# Altium project MD029A.PrjPcb (part 2 of 3)

## Sheet MD029A_CSA.SchDoc
size Letter; Date: Not shown in title block; ApprovedBy: Not shown in title block; CheckedBy: Not shown in title block; Author: Not shown in title block; CompanyName: Not shown in title block; Engineer: Not shown in title block; Organization: Not shown in title block; Address1: Not shown in title block; Address2: Not shown in title block; Address3: Not shown in title block; Address4: Not shown in title block; DocumentNumber: 3; Revision: Use project parameter SCH_Rev; SheetNumber: 3; SheetTotal: 5; PageSetup: Record=PageOptions|CenterHorizontal=True|CenterVertical=True|PrintScale=1.00|XCorrection=1.00|YCorrection=1.00|PrintKind=0|BorderSize=5000000|LeftOffset=0|BottomOffset=0|Orientation=2|PaperLength=1000|PaperWidth=1000|Scale=100|PaperSource=15|PrintQuality=600|MediaType=1|DitherType=10|PaperKind=Letter|PrintScaleMode=1; CurrentTime: Not shown in title block; CurrentDate: Not shown in title block; Time: Not shown in title block; DocumentFullPathAndName: Not shown in title block; DocumentName: Not shown in title block; ModifiedDate: Not shown in title block; ImagePath: Not shown in title block
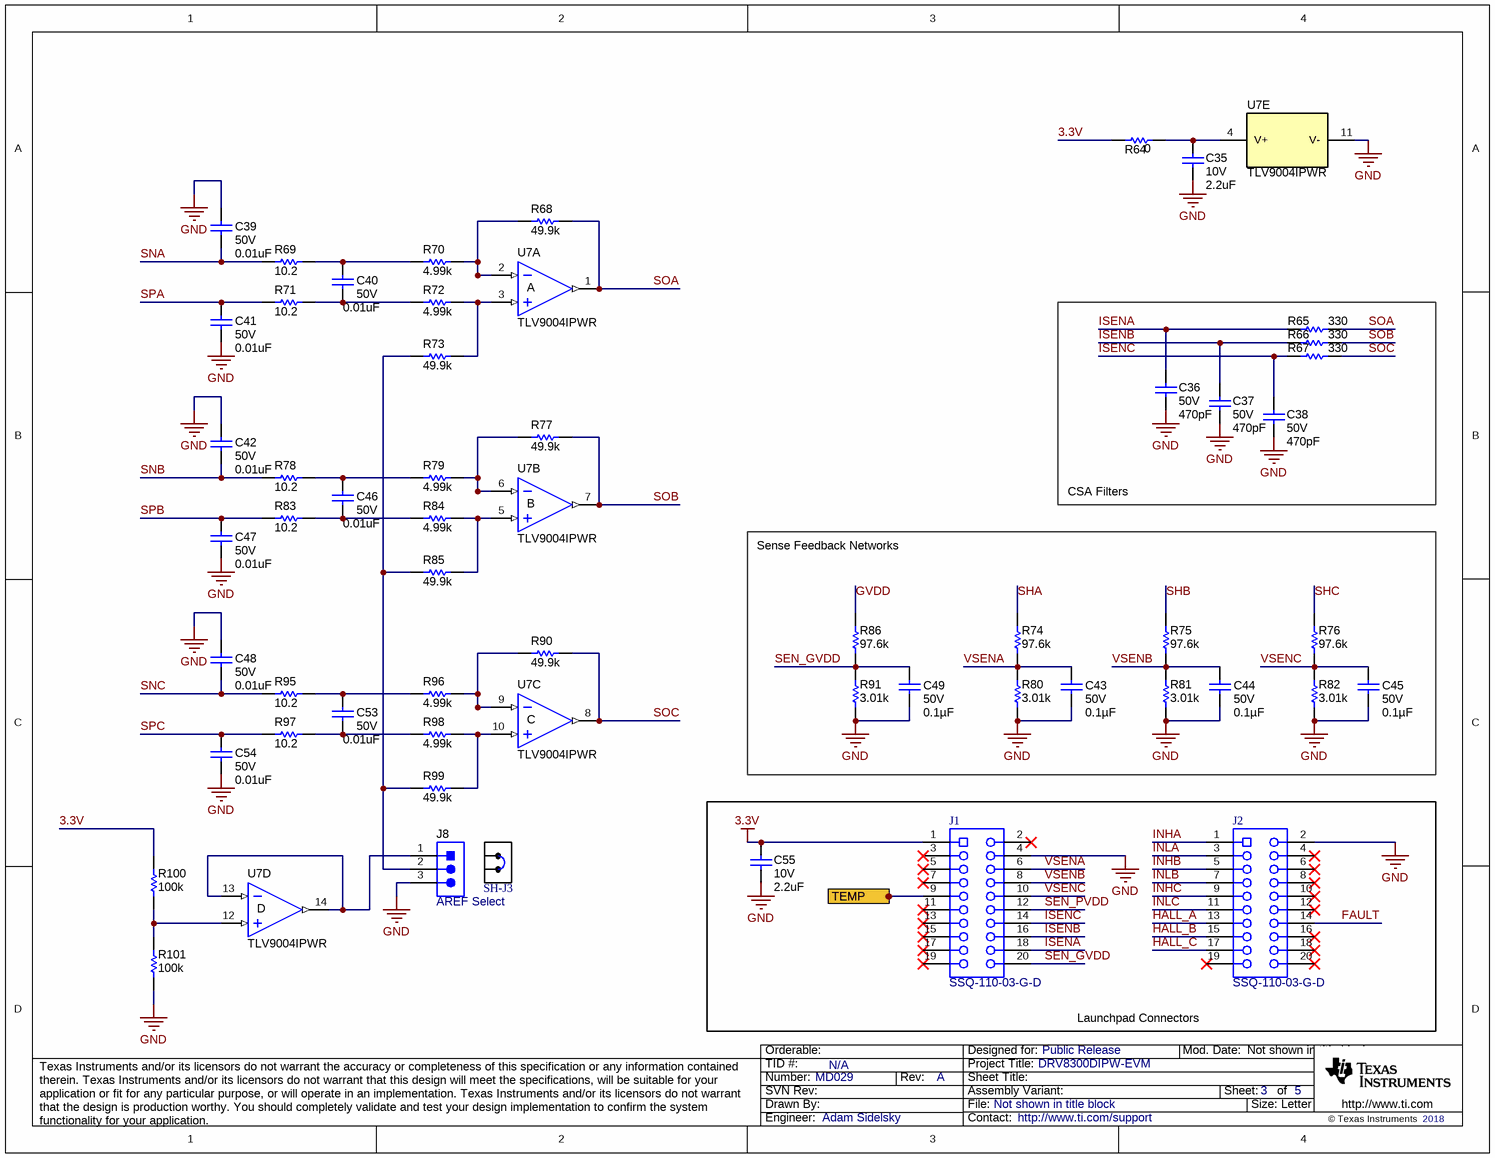
[diagram p2: MD029A_CSA.SchDoc]

### Parts
C35  VDC_V: 10V  ValueDisplayed: 2.2uF  [0402L]  (hidden comment: C1005X5R1A225K050BC)
C36  VDC_V: 50V  ValueDisplayed: 470pF  [0805L]  (hidden comment: C0805C471K5RACTU)
C37  VDC_V: 50V  ValueDisplayed: 470pF  [0805L]  (hidden comment: C0805C471K5RACTU)
C38  VDC_V: 50V  ValueDisplayed: 470pF  [0805L]  (hidden comment: C0805C471K5RACTU)
C39  VDC_V: 50V  ValueDisplayed: 0.01uF  [0603L]  (hidden comment: GCM188R71H103KA37D)
C40  VDC_V: 50V  ValueDisplayed: 0.01uF  [0603L]  (hidden comment: GCM188R71H103KA37D)
C41  VDC_V: 50V  ValueDisplayed: 0.01uF  [0603L]  (hidden comment: GCM188R71H103KA37D)
C42  VDC_V: 50V  ValueDisplayed: 0.01uF  [0603L]  (hidden comment: GCM188R71H103KA37D)
C43  Value2: 50V  ValueDisplayed: 0.1µF  [0603L]  (hidden comment: C0603C104K5RACAUTO)
C44  Value2: 50V  ValueDisplayed: 0.1µF  [0603L]  (hidden comment: C0603C104K5RACAUTO)
C45  Value2: 50V  ValueDisplayed: 0.1µF  [0603L]  (hidden comment: C0603C104K5RACAUTO)
C46  VDC_V: 50V  ValueDisplayed: 0.01uF  [0603L]  (hidden comment: GCM188R71H103KA37D)
C47  VDC_V: 50V  ValueDisplayed: 0.01uF  [0603L]  (hidden comment: GCM188R71H103KA37D)
C48  VDC_V: 50V  ValueDisplayed: 0.01uF  [0603L]  (hidden comment: GCM188R71H103KA37D)
C49  Value2: 50V  ValueDisplayed: 0.1µF  [0603L]  (hidden comment: C0603C104K5RACAUTO)
C53  VDC_V: 50V  ValueDisplayed: 0.01uF  [0603L]  (hidden comment: GCM188R71H103KA37D)
C54  VDC_V: 50V  ValueDisplayed: 0.01uF  [0603L]  (hidden comment: GCM188R71H103KA37D)
C55  VDC_V: 10V  ValueDisplayed: 2.2uF  [0402L]  (hidden comment: C1005X5R1A225K050BC)
J1  SSQ-110-03-G-D  [Samtec_SSQ-110-03-x-D]
J2  SSQ-110-03-G-D  [Samtec_SSQ-110-03-x-D]
J8  AREF Select  [WURTH_61300311121]
R64  value 0  [0603L]  (hidden comment: CRCW06030000Z0EA)
R65  ValueDisplayed: 330  [0805L]  (hidden comment: CRCW0805330RFKEAC)
R66  ValueDisplayed: 330  [0805L]  (hidden comment: CRCW0805330RFKEAC)
R67  ValueDisplayed: 330  [0805L]  (hidden comment: CRCW0805330RFKEAC)
R68  ValueDisplayed: 49.9k  [0603L]  (hidden comment: CRCW060349K9FKEA)
R69  ValueDisplayed: 10.2  [0603L]  (hidden comment: CRCW060310R2FKEA)
R70  ValueDisplayed: 4.99k  [0603L]  (hidden comment: CRCW06034K99FKEA)
R71  ValueDisplayed: 10.2  [0603L]  (hidden comment: CRCW060310R2FKEA)
R72  ValueDisplayed: 4.99k  [0603L]  (hidden comment: CRCW06034K99FKEA)
R73  ValueDisplayed: 49.9k  [0603L]  (hidden comment: CRCW060349K9FKEA)
R74  ValueDisplayed: 97.6k  [0603L]  (hidden comment: CRCW060397K6FKEA)
R75  ValueDisplayed: 97.6k  [0603L]  (hidden comment: CRCW060397K6FKEA)
R76  ValueDisplayed: 97.6k  [0603L]  (hidden comment: CRCW060397K6FKEA)
R77  ValueDisplayed: 49.9k  [0603L]  (hidden comment: CRCW060349K9FKEA)
R78  ValueDisplayed: 10.2  [0603L]  (hidden comment: CRCW060310R2FKEA)
R79  ValueDisplayed: 4.99k  [0603L]  (hidden comment: CRCW06034K99FKEA)
R80  ValueDisplayed: 3.01k  [0603L]  (hidden comment: CRCW06033K01FKEA)
R81  ValueDisplayed: 3.01k  [0603L]  (hidden comment: CRCW06033K01FKEA)
R82  ValueDisplayed: 3.01k  [0603L]  (hidden comment: CRCW06033K01FKEA)
R83  ValueDisplayed: 10.2  [0603L]  (hidden comment: CRCW060310R2FKEA)
R84  ValueDisplayed: 4.99k  [0603L]  (hidden comment: CRCW06034K99FKEA)
R85  ValueDisplayed: 49.9k  [0603L]  (hidden comment: CRCW060349K9FKEA)
R86  ValueDisplayed: 97.6k  [0603L]  (hidden comment: CRCW060397K6FKEA)
R90  ValueDisplayed: 49.9k  [0603L]  (hidden comment: CRCW060349K9FKEA)
R91  ValueDisplayed: 3.01k  [0603L]  (hidden comment: CRCW06033K01FKEA)
R95  ValueDisplayed: 10.2  [0603L]  (hidden comment: CRCW060310R2FKEA)
R96  ValueDisplayed: 4.99k  [0603L]  (hidden comment: CRCW06034K99FKEA)
R97  ValueDisplayed: 10.2  [0603L]  (hidden comment: CRCW060310R2FKEA)
R98  ValueDisplayed: 4.99k  [0603L]  (hidden comment: CRCW06034K99FKEA)
R99  ValueDisplayed: 49.9k  [0603L]  (hidden comment: CRCW060349K9FKEA)
R100  ValueDisplayed: 100k  [0603L]  (hidden comment: CRCW0603100KFKEA)
R101  ValueDisplayed: 100k  [0603L]  (hidden comment: CRCW0603100KFKEA)
SH-J3  SNT-100-BK-G  [SNT-100-BK-G]  (value not drawn)
U7  TLV9004IPWR  [PW0014A_N]  (parts A,B,C,D,E of 5)

### Blocks framed on the sheet
CSA Filters: C36-C38 R65-R67
Sense Feedback Networks: C43-C45 C49 R74-R76 R80-R82 R86 R91
Launchpad Connectors: C55 J1 J2

### Ports
TEMP (out)

### Nets
3.3V: C55.2 J1.1 R64.2 R100.2
GND: C35.1 C36.2 C37.2 C38.2 C39.1 C41.2 C42.1 C43.1 C44.1 C45.1 C47.2 C48.1 C49.1 C54.2 C55.1 J1.4 J2.2 J8.3 R80.1 R81.1 R82.1 R91.1 R101.1 U7.11(V-)
GVDD: R86.2
FAULT: J2.14
HALL_A: J2.13
HALL_B: J2.15
HALL_C: J2.17
INHA: J2.1
INHB: J2.5
INHC: J2.9
INLA: J2.3
INLB: J2.7
INLC: J2.11
ISENA: C36.1 J1.18 R65.1
ISENB: C37.1 J1.16 R66.1
ISENC: C38.1 J1.14 R67.1
SEN_GVDD: C49.2 J1.20 R86.1 R91.2
SEN_PVDD: J1.12
SHA: R74.2
SHB: R75.2
SHC: R76.2
SNA: C39.2 R69.1
SNB: C42.2 R78.1
SNC: C48.2 R95.1
SOA: R65.2 R68.2 U7.1(OUT)
SOB: R66.2 R77.2 U7.7(OUT)
SOC: R67.2 R90.2 U7.8(OUT)
SPA: C41.1 R71.1
SPB: C47.1 R83.1
SPC: C54.1 R97.1
TEMP: J1.9 ; port TEMP
VSENA: C43.2 J1.6 R74.1 R80.2
VSENB: C44.2 J1.8 R75.1 R81.2
VSENC: C45.2 J1.10 R76.1 R82.2
NetC35_2: C35.2 R64.1 U7.4(V+)
NetC40_1: C40.1 R69.2 R70.1
NetC40_2: C40.2 R71.2 R72.1
NetC46_1: C46.1 R78.2 R79.1
NetC46_2: C46.2 R83.2 R84.1
NetC53_1: C53.1 R95.2 R96.1
NetC53_2: C53.2 R97.2 R98.1
NetJ8_1: J8.1 U7.13(IN-) U7.14(OUT)
NetJ8_2: J8.2 R73.2 R85.2 R99.2
NetR68_1: R68.1 R70.2 U7.2(IN-)
NetR72_2: R72.2 R73.1 U7.3(IN+)
NetR77_1: R77.1 R79.2 U7.6(IN-)
NetR84_2: R84.2 R85.1 U7.5(IN+)
NetR90_1: R90.1 R96.2 U7.9(IN-)
NetR98_2: R98.2 R99.1 U7.10(IN+)
NetR100_1: R100.1 R101.2 U7.12(IN+)

Not connected (* = marked no-connect by the designer): J1 2* 3* 5* 7* 11* 13* 15* 17* 19*; J2 4* 6* 8* 10* 12* 16* 18* 19* 20*

### Notes on the sheet
- Drawn By:
- SVN Rev:
- Number:
- TID #:
- Orderable:
- Rev:
- Sheet Title:
- File:
- Project Title:
- Designed for:
- Assembly Variant:
- Mod. Date:
- Sheet:
- Size:
- of
- Letter
- http://www.ti.com
- Texas Instruments and/or its licensors do not warrant the accuracy or completeness of this specification or any information contained therein. Texas Instruments and/or its licensors do not warrant that this design will meet the specifications, will be suitable for your application or fit for any particular purpose, or will operate in an implementation. Texas Instruments and/or its licensors do not warrant that the design is production worthy. You should completely validate and test your design implementation to confirm the system functionality for your application.
- Engineer:
- Contact:
- © Texas Instruments
- (in symbol CMP-0860067-1, part A) A
- (in symbol CMP-0860067-1, part B) B
- (in symbol CMP-0860067-1, part C) C
- (in symbol CMP-0860067-1, part D) D

### Library data of the parts
C35 C55 = CMP-0006263-2: CAP, CERM, 2.2 uF, 10 V, +/- 10%, X5R, 0402; Manufacturer: TDK; TaMin_C: -55°C; Polarized: N; SizeAreaWB_mm2: 3; Value1: Unknown; U/M: EA; Value: 2.2uF; TaMax_C: 85°C; SizeZ_mm: 0.6; SizeX_mm: 1; SizeY_mm: 0.5; Cap_Case: 0402; Cap_F: 2.2µF; AEC Category: Q200; Supplier Part Number 2: 87R3267; Publisher: Texas Instruments; Supplier 2: Newark; TempCo: X5R; Published: 2008-06-19; RoHS: Y; MountType: SMT; Supplier 1: Digi-Key; PackageReference: 0402; Tolerance_%: 10%; Value2: 10V; SizeArea_mm2: 0.5; CompType: Capacitor; LatestRevisionDate: 2017-03-09; PartNumber: C1005X5R1A225K050BC; AEC Qualified: N; ComponentLink1Description: Datasheet link; AEC Grade: N/A; Supplier Part Number 1: 445-7392-1-ND; Technology: Ceramic; ComponentLink1URL: http://product.tdk.com/en/catalog/datasheets/mlcc_commercial_general_en.pdf
C36-C38 = CMP-0007796-2: CAP, CERM, 470 pF, 50 V, +/- 10%, X7R, 0805; Manufacturer: Kemet; TaMin_C: -55°C; ESR_ohm: 0.688; Polarized: N; SizeAreaWB_mm2: 6.75; Value1: 0.688 ohm; U/M: EA; Value: 470pF; TaMax_C: 125°C; SizeZ_mm: 1.45; SizeX_mm: 2; SizeY_mm: 1.25; Cap_Case: 0805; SizeArea_mm2: 2.5; IRMS_A: 213mA; AEC Category: Q200; Supplier Part Number 2: 80-C0805C471K5R; Publisher: Texas Instruments; Supplier 2: Mouser; TempCo: X7R; Published: 2008-06-19; RoHS: Y; MountType: SMT; Supplier 1: Digi-Key; PackageReference: 0805; Tolerance_%: 10%; Value2: 50V; CompType: Capacitor; LatestRevisionDate: 2017-03-09; PartNumber: C0805C471K5RACTU; AEC Qualified: ?; Cap_F: 470pF; ComponentLink1Description: Datasheet link; Supplier Part Number 1: 399-1142-1-ND; Technology: Ceramic; ComponentLink1URL: http://www.kemet.com/kemet/web/homepage/kechome.nsf/file/Partial%20Copy%20-%20Ceramic%20Surface%20Mount%20Capacitors/$file/F3102_CE.pdf
C39-C42 C46-C48 C53 C54 = CMP-0007143-4: CAP, CERM, 0.01 uF, 50 V, +/- 10%, X7R, AEC-Q200 Grade 1, 0603; Manufacturer: MuRata; TaMin_C: -55°C; Polarized: N; SizeAreaWB_mm2: 4.68; Value1: Unknown; U/M: EA; Value: 0.01uF; TaMax_C: 125°C; SizeZ_mm: 1; SizeX_mm: 1.6; SizeY_mm: 0.8; Cap_Case: 0603; SizeArea_mm2: 1.28; AEC Qualified: Y; Cap_F: 10nF; AEC Category: Q200; Supplier Part Number 2: 45Y5166; Publisher: Texas Instruments; Supplier 2: Newark; Supplier Part Number 3: 81-GCM188R71H103KA7D; TempCo: X7R; Supplier 3: Mouser; Published: 2008-06-19; RoHS: Y; MountType: SMT; Supplier 1: Digi-Key; PackageReference: 0603; Tolerance_%: 10%; Value2: 50V; CompType: Capacitor; LatestRevisionDate: 2017-03-09; PartNumber: GCM188R71H103KA37D; ComponentLink1Description: Datasheet link; AEC Grade: 1; Supplier Part Number 1: 490-4778-1-ND; Technology: Ceramic; ComponentLink1URL: http://psearch.en.murata.com/capacitor/product/GCM188R71H103KA37%23.pdf
C43-C45 C49 = CMP-0079602-1: CAP, CERM, 0.1 µF, 50 V,+/- 10%, X7R, AEC-Q200 Grade 1, 0603; Manufacturer: Kemet; TaMin_C: -55°C; Polarized: N; SizeAreaWB_mm2: 4.68; U/M: EA; Value: 0.1uF; TaMax_C: 125°C; SizeZ_mm: 1; SizeX_mm: 1.6; SizeY_mm: 0.8; Cap_Case: 0603; SizeArea_mm2: 1.28; AEC Qualified: Y; Cap_F: 100nF; AEC Category: Q200; ComponentLink1URL: https://search.kemet.com/component-edge/download/specsheet/C0603C104K5RACAUTO.pdf; Supplier Part Number 2: 96Y6965; Supplier 2: Newark; Supplier Part Number 3: 80-C0603C104K5RAUTO; TempCo: X7R; Supplier 3: Mouser; RoHS: Y; MountType: SMT; Supplier 1: Digi-Key; PackageReference: 0603; Tolerance_%: 10%; CompType: Capacitor; PartNumber: C0603C104K5RACAUTO; VDC_V: 50V; ComponentLink1Description: Datasheet link; AEC Grade: 1; Supplier Part Number 1: 399-6856-1-ND; Technology: Ceramic
J1 J2 = CMP-0075613-1: Receptacle, 2.54mm, 10x2, Gold, TH; Manufacturer: Samtec; Pitch_mm: 2.54; Cert_VDE: N; Gender: Female; Cert_CSA: Y; Current_A: 6.3A; Voltage_V: 550V; CT: True; Row_Count: 2; CompType: Socket Strip; CNHeader: False; ComponentLink1Description: Datasheet URL; RoHS: Y; Cert_UL: Y; Orientation: Vertical; PackageReference: Receptacle, 2.54mm, 10x2, TH; Color: Black; PartNumber: SSQ-110-03-G-D; PinCount: 20; Publisher: Texas Instruments; ContactFinish: Gold; Cert_CULUS: N; RowSpacing_mm: 2.54; ComponentLink1URL: https://www.samtec.com/ftppub/cpdf/SSQ-1XX-XX-XXX-X-XX-XXX-XX-X-MKT.pdf; LatestRevisionDate: 2017-07-12; MountType: TH
J8 = CMP-0054796-2: Header, 2.54 mm, 3x1, Gold, TH; Manufacturer: Wurth Elektronik; PartNumber: 61300311121; Green_Lifecycle: Active; Green_REACh: Passed; Cert_UL: Y; Gender: Male; Pitch_mm: 2.54; Row_Count: 1; Shrouded: N; ComponentLink1URL: http://katalog.we-online.de/em/datasheet/6130xx11121.pdf; ClassName: Header; Supplier Part Number 2: 20X0950; Supplier 2: Newark; Supplier Part Number 3: 356154; Supplier 3: Farnell; RoHS: Y; MountType: TH; Green_EU RoHS-2: Incomplete; Supplier 1: Digi-Key; Green_EU RoHS: Passed; PackageReference: Header, 2.54mm, 3x1, TH; CompType: Header; ComponentLink1Description: Datasheet URL; Supplier Part Number 1: 732-5316-ND; Color: Black; ContactFinish: Gold; Orientation: Vertical; PinCount: 3
R64 = CMP-0025697-4: RES, 0, 5%, 0.1 W, AEC-Q200 Grade 0, 0603; Manufacturer: Vishay-Dale; Value_Code: 0000; Power_W: 100mW; Value2: 0.1W; VDC_V: 75V; TempCo: 200 ppm/C; EIA_Code: E24; AEC Category: Q200; AEC Qualified: Y; SizeArea_mm2: 1.28; SizeX_mm: 1.6; SizeY_mm: 0.8; SizeZ_mm: 1; CompType: Resistor; PartNumber: CRCW06030000Z0EA; PackageReference: 0603; RoHS: E; Res_ohm: 0; Tolerance_%: 5%; Value1: 5%; MountType: SMT; Technology: Thick Film; ComponentLink1Description: Datasheet link; ComponentLink1URL: http://www.vishay.com/docs/20035/dcrcwe3.pdf; Supplier 1: Digi-Key; Supplier Part Number 1: 541-0.0GCT-ND; Supplier 2: Newark; Supplier Part Number 2: 52K8014; Supplier 3: Mouser; Supplier Part Number 3: 71-CRCW0603-0-E3; ValueDisplayed: 0; AEC Grade: 0
R65-R67 = CMP-0082535-1: RES, 330, 1%, 0.125 W, 0805; Manufacturer: Vishay-Dale; Power_W: 125mW; TempCo: 100 ppm/C; SizeAreaWB_mm2: 6.75; Value_Code: 330R; Value: 330; SizeX_mm: 2; SizeY_mm: 1.25; SizeZ_mm: 1.45; Value2: 0.125W; SizeArea_mm2: 2.5; AEC Qualified: N; VDC_V: 150V; AEC Category: Q200; ComponentLink1URL: http://www.vishay.com/docs/28773/crcwce3.pdf; Supplier Part Number 2: 71-CRCW0805330RFKEAC; Supplier 2: Mouser; RoHS: E; Value1: 1%; MountType: SMT; Supplier 1: Digi-Key; PackageReference: 0805; Tolerance_%: 1%; Res_ohm: 330; CompType: Resistor; PartNumber: CRCW0805330RFKEAC; ComponentLink1Description: Datasheet link; AEC Grade: N/A; Supplier Part Number 1: 541-4142-1-ND; Technology: Thick Film
R68 R73 R77 R85 R90 R99 = CMP-0022447-4: RES, 49.9 k, 1%, 0.1 W, AEC-Q200 Grade 0, 0603; Manufacturer: Vishay-Dale; Power_W: 100mW; TempCo: 100 ppm/C; Value_Code: 49k9; Value: 49.9k; EIA_Code: E96; SizeX_mm: 1.6; SizeY_mm: 0.8; SizeZ_mm: 1; Value2: 0.1W; SizeArea_mm2: 1.28; AEC Qualified: Y; VDC_V: 75V; AEC Category: Q200; AEC Grade: 0; Supplier Part Number 2: 71-CRCW0603-49.9K-E3; Supplier 2: Mouser; Supplier Part Number 3: 1652882; Supplier 3: Farnell; RoHS: E; Value1: 1%; MountType: SMT; Supplier 1: Digi-Key; PackageReference: 0603; Tolerance_%: 1%; Res_ohm: 49.9k; CompType: Resistor; PartNumber: CRCW060349K9FKEA; ComponentLink1Description: Datasheet link; Supplier Part Number 1: 541-49.9KHCT-ND; Technology: Thick Film; ComponentLink1URL: http://www.vishay.com/docs/20035/dcrcwe3.pdf
R69 R71 R78 R83 R95 R97 = CMP-0022005-4: RES, 10.2, 1%, 0.1 W, AEC-Q200 Grade 0, 0603; Manufacturer: Vishay-Dale; Power_W: 100mW; TempCo: 100 ppm/C; Value_Code: 10R2; Value: 10.2; EIA_Code: E96; SizeX_mm: 1.6; SizeY_mm: 0.8; SizeZ_mm: 1; Value2: 0.1W; SizeArea_mm2: 1.28; AEC Qualified: Y; VDC_V: 75V; AEC Category: Q200; AEC Grade: 0; Supplier Part Number 2: 71-CRCW0603-10.2-E3; Supplier 2: Mouser; Supplier Part Number 3: 1157185; Supplier 3: Farnell; RoHS: E; Value1: 1%; MountType: SMT; Supplier 1: Digi-Key; PackageReference: 0603; Tolerance_%: 1%; Res_ohm: 10.2; CompType: Resistor; PartNumber: CRCW060310R2FKEA; ComponentLink1Description: Datasheet link; Supplier Part Number 1: 541-10.2HCT-ND; Technology: Thick Film; ComponentLink1URL: http://www.vishay.com/docs/20035/dcrcwe3.pdf
R70 R72 R79 R84 R96 R98 = CMP-0022458-4: RES, 4.99 k, 1%, 0.1 W, AEC-Q200 Grade 0, 0603; Manufacturer: Vishay-Dale; Power_W: 100mW; TempCo: 100 ppm/C; Value_Code: 4k99; Value: 4.99k; EIA_Code: E96; SizeX_mm: 1.6; SizeY_mm: 0.8; SizeZ_mm: 1; Value2: 0.1W; SizeArea_mm2: 1.28; AEC Qualified: Y; VDC_V: 75V; AEC Category: Q200; AEC Grade: 0; Supplier Part Number 2: 52K8500; Supplier 2: Newark; Supplier Part Number 3: 71-CRCW0603-4.99K-E3; Supplier 3: Mouser; RoHS: E; Value1: 1%; MountType: SMT; Supplier 1: Digi-Key; PackageReference: 0603; Tolerance_%: 1%; Res_ohm: 4.99k; CompType: Resistor; PartNumber: CRCW06034K99FKEA; ComponentLink1Description: Datasheet link; Supplier Part Number 1: 541-4.99KHCT-ND; Technology: Thick Film; ComponentLink1URL: http://www.vishay.com/docs/20035/dcrcwe3.pdf
R74-R76 R86 = CMP-0022663-4: RES, 97.6 k, 1%, 0.1 W, AEC-Q200 Grade 0, 0603; Manufacturer: Vishay-Dale; Power_W: 100mW; TempCo: 100 ppm/C; Value_Code: 97k6; Value: 97.6k; EIA_Code: E96; SizeX_mm: 1.6; SizeY_mm: 0.8; SizeZ_mm: 1; Value2: 0.1W; SizeArea_mm2: 1.28; AEC Qualified: Y; VDC_V: 75V; AEC Category: Q200; AEC Grade: 0; Supplier Part Number 2: 52K8787; Supplier 2: Newark; Supplier Part Number 3: 71-CRCW0603-97.6K-E3; Supplier 3: Mouser; RoHS: E; Value1: 1%; MountType: SMT; Supplier 1: Digi-Key; PackageReference: 0603; Tolerance_%: 1%; Res_ohm: 97.6k; CompType: Resistor; PartNumber: CRCW060397K6FKEA; ComponentLink1Description: Datasheet link; Supplier Part Number 1: 541-97.6KHCT-ND; Technology: Thick Film; ComponentLink1URL: http://www.vishay.com/docs/20035/dcrcwe3.pdf
R80-R82 R91 = CMP-0022371-4: RES, 3.01 k, 1%, 0.1 W, AEC-Q200 Grade 0, 0603; Manufacturer: Vishay-Dale; Power_W: 100mW; TempCo: 100 ppm/C; Value_Code: 3k01; Value: 3.01k; EIA_Code: E96; SizeX_mm: 1.6; SizeY_mm: 0.8; SizeZ_mm: 1; Value2: 0.1W; SizeArea_mm2: 1.28; AEC Qualified: Y; VDC_V: 75V; AEC Category: Q200; AEC Grade: 0; Supplier Part Number 2: 52K8370; Supplier 2: Newark; Supplier Part Number 3: 71-CRCW0603-3.01K-E3; Supplier 3: Mouser; RoHS: E; Value1: 1%; MountType: SMT; Supplier 1: Digi-Key; PackageReference: 0603; Tolerance_%: 1%; Res_ohm: 3.01k; CompType: Resistor; PartNumber: CRCW06033K01FKEA; ComponentLink1Description: Datasheet link; Supplier Part Number 1: 541-3.01KHCT-ND; Technology: Thick Film; ComponentLink1URL: http://www.vishay.com/docs/20035/dcrcwe3.pdf
R100 R101 = CMP-0021990-4: RES, 100 k, 1%, 0.1 W, AEC-Q200 Grade 0, 0603; Manufacturer: Vishay-Dale; Power_W: 100mW; TempCo: 100 ppm/C; Value: 100k; EIA_Code: E96; SizeX_mm: 1.6; SizeY_mm: 0.8; SizeZ_mm: 1; Value2: 0.1W; SizeArea_mm2: 1.28; AEC Qualified: Y; VDC_V: 75V; AEC Category: Q200; AEC Grade: 0; Supplier Part Number 2: 42K3668; Supplier 2: Newark; Supplier Part Number 3: 71-CRCW0603-100K-E3; Supplier 3: Mouser; Value_Code: 100k; RoHS: E; Value1: 1%; MountType: SMT; Supplier 1: Digi-Key; PackageReference: 0603; Tolerance_%: 1%; Res_ohm: 100k; CompType: Resistor; PartNumber: CRCW0603100KFKEA; ComponentLink1Description: Datasheet link; Supplier Part Number 1: 541-100KHCT-ND; Technology: Thick Film; ComponentLink1URL: http://www.vishay.com/docs/20035/dcrcwe3.pdf
SH-J3 = CMP-0003623-3: as SH-J1 on sheet MD029A_DRV8300; ComponentLink1URL: http://www.samtec.com/ftppub/pdf/SNT.PDF; Supplier 1: Digi-Key; CompType: Shunt; PackageReference: Shunt; ClassName: Shunt; RoHS: Y; Supplier Part Number 1: SAM8858-ND; MountType: N/A; PartNumber: SNT-100-BK-G; ComponentLink1Description: Datasheet Link
U7 = CMP-0860067-1: 4-Channel, 1MHz, RRIO, 1.8V to 5.5V Operational Amplifier for Cost-Optimized Systems, PW0014A (TSSOP-14); Alternate Manufacturer: Texas Instruments; Rating: Catalog; SizeY_mm: 5; CompType: IC; SizeAreaWB_mm2: 58.8; AEC Qualified: N; SizeArea_mm2: 32; SizeZ_mm: 1.2; SizeX_mm: 6.4; AEC Category: Q200; ComponentLink2URL: http://www.ti.com/product/tlv9004; ComponentLink1URL: http://www.ti.com/lit/ds/symlink/tlv9004.pdf; PackageDescription: TSSOP-14; ComponentLink3Description: Online Datasheet; ComponentLink2Description: Product Folder; ComponentLink1Description: Datasheet Link; Manufacturer: Texas Instruments; PartNumber: TLV9004IPWR; PackageReference: PW0014A; RoHS: Y; MountType: SMT; Operating Temperature Range: -40 to 125 C; ComponentLink3URL: http://www.ti.com/product/tlv9004/datasheet; PartId: 1

## Sheet MD029A_Power.SchDoc
size Letter; Date: Not shown in title block; ApprovedBy: Not shown in title block; CheckedBy: Not shown in title block; Author: Not shown in title block; CompanyName: Not shown in title block; Engineer: Not shown in title block; Organization: Not shown in title block; Address1: Not shown in title block; Address2: Not shown in title block; Address3: Not shown in title block; Address4: Not shown in title block; DocumentNumber: 4; Revision: Use project parameter SCH_Rev; SheetNumber: 4; SheetTotal: 5; PageSetup: Record=PageOptions|CenterHorizontal=True|CenterVertical=True|PrintScale=1.00|XCorrection=1.00|YCorrection=1.00|PrintKind=0|BorderSize=5000000|LeftOffset=0|BottomOffset=0|Orientation=2|PaperLength=1000|PaperWidth=1000|Scale=100|PaperSource=15|PrintQuality=600|MediaType=1|DitherType=10|PaperKind=Letter|PrintScaleMode=1; CurrentTime: Not shown in title block; CurrentDate: Not shown in title block; Time: Not shown in title block; DocumentFullPathAndName: Not shown in title block; DocumentName: Not shown in title block; ModifiedDate: Not shown in title block; ImagePath: Not shown in title block
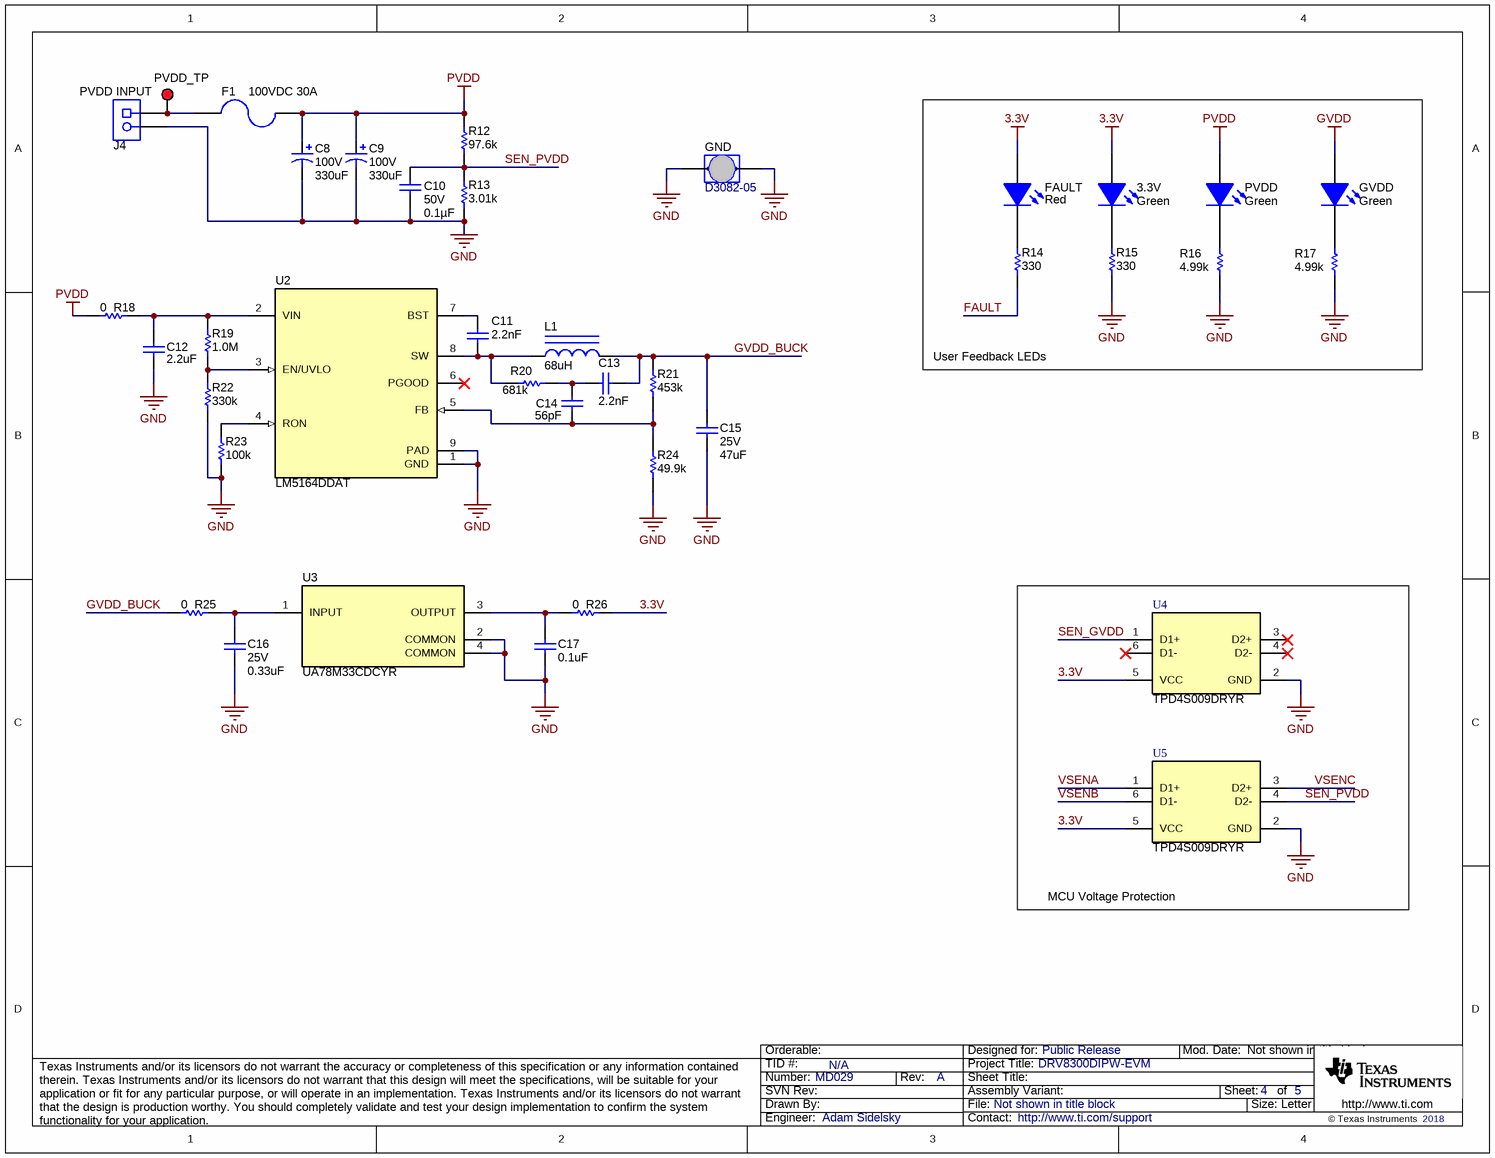
[diagram p3: MD029A_Power.SchDoc]

### Parts
3.3V  value Green  [LED_LTST-C171]
C8  VDC_V: 100V  ValueDisplayed: 330uF  [SM_RADIAL_K16]  (hidden comment: EEV-FK2A331M)
C9  VDC_V: 100V  ValueDisplayed: 330uF  [SM_RADIAL_K16]  (hidden comment: EEV-FK2A331M)
C10  Value2: 50V  ValueDisplayed: 0.1µF  [0603L]  (hidden comment: C0603C104K5RACAUTO)
C11  Cap_F: 2.2nF  [0603L]  (hidden comment: CGA3E2X7R2A222K080AA)
C12  ValueDisplayed: 2.2uF  [1210_210L]  (hidden comment: C1210C225K1RACTU)
C13  Cap_F: 2.2nF  [0603L]  (hidden comment: CGA3E2X7R2A222K080AA)
C14  ValueDisplayed: 56pF  [0603L]  (hidden comment: GRM1885C2A560JA01D)
C15  VDC_V: 25V  ValueDisplayed: 47uF  [1206L]  (hidden comment: C3216JB1E476M160AC)
C16  VDC_V: 25V  ValueDisplayed: 0.33uF  [0805L]  (hidden comment: 08053D334KAT2A)
C17  ValueDisplayed: 0.1uF  [0603L]  (hidden comment: C0603C104J4RACTU)
F1  100VDC 30A  [Fuse_0463]
FAULT  value Red  [LED_LTST-C170_Red]
GND  D3082-05  [Harwin_D3082-05]
GVDD  value Green  [LED_LTST-C171]
J4  PVDD INPUT  [Phoenix_1902547]
L1  ValueDisplayed: 68uH  [SDR1006]  (hidden comment: SDR1006-680KL)
PVDD  value Green  [LED_LTST-C171]
PVDD_TP  5000  [Keystone5000]  (value not drawn)
R12  ValueDisplayed: 97.6k  [0603L]  (hidden comment: CRCW060397K6FKEA)
R13  ValueDisplayed: 3.01k  [0603L]  (hidden comment: CRCW06033K01FKEA)
R14  ValueDisplayed: 330  [0603L]  (hidden comment: CRCW0603330RJNEA)
R15  ValueDisplayed: 330  [0603L]  (hidden comment: CRCW0603330RJNEA)
R16  value 4.99k  [0603L]  (hidden comment: CRCW06034K99FKEA)
R17  value 4.99k  [0603L]  (hidden comment: CRCW06034K99FKEA)
R18  value 0  [0603L]  (hidden comment: CRCW06030000Z0EA)
R19  ValueDisplayed: 1.0M  [0603L]  (hidden comment: CRCW06031M00JNEA)
R20  ValueDisplayed: 681k  [0603L]  (hidden comment: RC0603FR-07681KL)
R21  ValueDisplayed: 453k  [0603L]  (hidden comment: RC0603FR-07453KL)
R22  ValueDisplayed: 330k  [0603L]  (hidden comment: CRCW0603330KJNEA)
R23  ValueDisplayed: 100k  [0402L]  (hidden comment: CRCW0402100KFKED)
R24  ValueDisplayed: 49.9k  [0603L]  (hidden comment: RC0603FR-0749K9L)
R25  value 0  [0603L]  (hidden comment: CRCW06030000Z0EA)
R26  value 0  [0603L]  (hidden comment: CRCW06030000Z0EA)
U2  LM5164DDAT  [DDA0008E_N]
U3  UA78M33CDCYR  [DCY0004A_N]
U4  TPD4S009DRYR  [DRY0006A]
U5  TPD4S009DRYR  [DRY0006A]

### Blocks framed on the sheet
User Feedback LEDs: 3.3V FAULT GVDD PVDD R14-R17
MCU Voltage Protection: U4 U5

### Nets
3.3V: 3.3V.1(A) FAULT.1(A) R26.2 U4.5(VCC) U5.5(VCC)
GND: C8.2(-) C9.2(-) C10.1 C12.2 C15.2 C16.2 C17.2 GND.1 GND.2 J4.2 R13.1 R15.1 R16.1 R17.1 R22.1 R23.1 R24.1 U2.1(GND) U2.9(PAD) U3.2(COMMON) U3.4(COMMON) U4.2(GND) U5.2(GND)
GVDD: GVDD.1(A)
PVDD: C8.1(+) C9.1(+) F1.1 PVDD.1(A) R12.2 R18.1
FAULT: R14.1
GVDD_BUCK: C13.1 C15.1 L1.2 R21.2 R25.1
SEN_GVDD: U4.1(D1+)
SEN_PVDD: C10.2 R12.1 R13.2 U5.4(D2-)
VSENA: U5.1(D1+)
VSENB: U5.6(D1-)
VSENC: U5.3(D2+)
Net3.3V_2: 3.3V.2(K) R15.2
NetC11_1: C11.1 U2.7(BST)
NetC11_2: C11.2 L1.1 R20.1 U2.8(SW)
NetC12_1: C12.1 R18.2 R19.2 U2.2(VIN)
NetC13_2: C13.2 C14.1 R20.2
NetC14_2: C14.2 R21.1 R24.2 U2.5(FB)
NetC16_1: C16.1 R25.2 U3.1(INPUT)
NetC17_1: C17.1 R26.1 U3.3(OUTPUT)
NetF1_2: F1.2 J4.1 PVDD_TP.1
NetFAULT_2: FAULT.2(K) R14.2
NetGVDD_2: GVDD.2(K) R17.2
NetPVDD_2: PVDD.2(K) R16.2
NetR19_1: R19.1 R22.2 U2.3(EN/UVLO)
NetR23_2: R23.2 U2.4(RON)

Not connected (* = marked no-connect by the designer): U2 6(PGOOD)*; U4 3(D2+)* 4(D2-)* 6(D1-)*

### Notes on the sheet
- Drawn By:
- SVN Rev:
- Number:
- TID #:
- Orderable:
- Rev:
- Sheet Title:
- File:
- Project Title:
- Designed for:
- Assembly Variant:
- Mod. Date:
- Sheet:
- Size:
- of
- Letter
- http://www.ti.com
- Texas Instruments and/or its licensors do not warrant the accuracy or completeness of this specification or any information contained therein. Texas Instruments and/or its licensors do not warrant that this design will meet the specifications, will be suitable for your application or fit for any particular purpose, or will operate in an implementation. Texas Instruments and/or its licensors do not warrant that the design is production worthy. You should completely validate and test your design implementation to confirm the system functionality for your application.
- Engineer:
- Contact:
- © Texas Instruments

### Library data of the parts
3.3V GVDD PVDD = CMP-0002830-3: LED, Green, SMD; Manufacturer: Lite-On; PartNumber: LTST-C171GKT; Vf_V: 2.1V; Io_A: 20A; Value1: W; SizeArea_mm2: 2.5; SizeAreaWB_mm2: 6.75; SizeX_mm: 2; SizeY_mm: 1.25; SizeZ_mm: 1.2; CompType: LED; MountType: SMT; RoHS: Y; PackageReference: 0805 LED; Type: AlInGaP; Value2: 2.1V; Color: green; ComponentLink1URL: https://sps06.itg.ti.com/sites/KMS/crossdivteams/altium/docs/ComponentDatasheets/LTST-C171GKT.pdf; ComponentLink1Description: Datasheet link
C8 C9 = CMP-0011224-2: CAP, AL, 330 uF, 100 V, +/- 20%, 0.153 ohm, AEC-Q200 Grade 2, SMD; Manufacturer: Panasonic; TaMin_C: -55°C; ESR_ohm: 1.53d; Polarized: Y; SizeAreaWB_mm2: 483; U/M: EA; Value: 330uF; TaMax_C: 105°C; SizeZ_mm: 16.5; SizeX_mm: 21; SizeY_mm: 19; Cap_Case: K16; SizeArea_mm2: 399; CompType: Capacitor; Cap_F: 330µF; IRMS_A: 9.17dA; AEC Grade: 2; AEC Category: Q200; Supplier Part Number 2: 667-EEV-FK2A331M; Publisher: Texas Instruments; Supplier 2: Mouser; RoHS: Y; Value1: 0.153 ohm; MountType: SMT; Supplier 1: Digi-Key; PackageReference: SMT Radial K16; Tolerance_%: 20%; Value2: 100V; LatestRevisionDate: 2017-03-09; PartNumber: EEV-FK2A331M; AEC Qualified: Y; Series: FK; ComponentLink1Description: Datasheet link; Supplier Part Number 1: PCE3505CT-ND; Technology: AL; ComponentLink1URL: https://industrial.panasonic.com/cdbs/www-data/pdf/RDE0000/ABA0000C1181.pdf
C10 = CMP-0079602-1: as C43 on sheet MD029A_CSA; ComponentLink1URL: https://search.kemet.com/component-edge/download/specsheet/C0603C104K5RACAUTO.pdf; Supplier Part Number 2: 96Y6965; Supplier 2: Newark; Supplier Part Number 3: 80-C0603C104K5RAUTO; TempCo: X7R; Supplier 3: Mouser; RoHS: Y; MountType: SMT; Supplier 1: Digi-Key; PackageReference: 0603; Tolerance_%: 10%; CompType: Capacitor; PartNumber: C0603C104K5RACAUTO; VDC_V: 50V; ComponentLink1Description: Datasheet link; AEC Grade: 1; Supplier Part Number 1: 399-6856-1-ND; Technology: Ceramic
C11 C13 = CMP-0007085-4: CAP, CERM, 2200 pF, 100 V, +/- 10%, X7R, AEC-Q200 Grade 1, 0603; Manufacturer: TDK; TaMin_C: -55°C; ESR_ohm: 0.923948; Polarized: N; SizeAreaWB_mm2: 4.68; Value1: 0.923948 ohm; U/M: EA; Value: 2200pF; TaMax_C: 125°C; SizeZ_mm: 1; SizeX_mm: 1.6; SizeY_mm: 0.8; Cap_Case: 0603; Value2: 100V; SizeArea_mm2: 1.28; AEC Qualified: Y; IRMS_A: 295.638mA; AEC Category: Q200; Supplier Part Number 2: 810-CGA3E2X7R2A222K080AA; Publisher: Texas Instruments; Supplier 2: Mouser; TempCo: X7R; Published: 2008-06-19; RoHS: Y; MountType: SMT; Supplier 1: Digi-Key; PackageReference: 0603; Tolerance_%: 10%; CompType: Capacitor; LatestRevisionDate: 2017-03-09; PartNumber: CGA3E2X7R2A222K080AA; VDC_V: 100V; ComponentLink1Description: Datasheet link; AEC Grade: 1; Supplier Part Number 1: 445-5808-1-ND; Technology: Ceramic; ValueDisplayed: 2200pF; ComponentLink1URL: https://product.tdk.com/en/search/capacitor/ceramic/mlcc/info?part_no=CGA3E2X7R2A222K080AA
C12 = CMP-0009084-1: CAP, CERM, 2.2 uF, 100 V, +/- 10%, X7R, 1210; Manufacturer: Kemet; TaMin_C: -55°C; Polarized: N; SizeAreaWB_mm2: 14.7; Value1: Unknown; U/M: EA; Value: 2.2uF; TaMax_C: 125°C; SizeZ_mm: 2.1; SizeX_mm: 3.2; SizeY_mm: 2.5; Cap_Case: 1210; Value2: 100V; SizeArea_mm2: 8; Cap_F: 2.2µF; AEC Category: Q200; ComponentLink1URL: http://capacitoredge.kemet.com/capedge2/intellispec.jsp?pn=C1210C225K1RACTU&displayPN=C1210C225K1RACTU; Supplier Part Number 2: 60M1009; Publisher: Texas Instruments; Supplier 2: Newark; Supplier Part Number 3: 2392437; TempCo: X7R; Supplier 3: Farnell; Published: 2008-06-19; RoHS: Y; MountType: SMT; Supplier 1: Digi-Key; PackageReference: 1210; Tolerance_%: 10%; CompType: Capacitor; LatestRevisionDate: 2017-03-09; PartNumber: C1210C225K1RACTU; AEC Qualified: N; VDC_V: 100V; ComponentLink1Description: Datasheet link; AEC Grade: N/A; Supplier Part Number 1: 399-5511-2-ND; Technology: Ceramic
C14 = CMP-0007275-4: CAP, CERM, 56 pF, 100 V, +/- 5%, C0G/NP0, 0603; Manufacturer: MuRata; TaMin_C: -55°C; Polarized: N; SizeAreaWB_mm2: 4.68; Value1: Unknown; U/M: EA; Value: 56pF; TaMax_C: 125°C; SizeZ_mm: 1; SizeX_mm: 1.6; SizeY_mm: 0.8; Cap_Case: 0603; Value2: 100V; SizeArea_mm2: 1.28; AEC Category: Q200; Supplier Part Number 2: 81-GRM185C2A560JA01D; Publisher: Texas Instruments; Supplier 2: Mouser; TempCo: C0G/NP0; Published: 2008-06-19; RoHS: Y; MountType: SMT; Supplier 1: Digi-Key; PackageReference: 0603; Tolerance_%: 5%; CompType: Capacitor; LatestRevisionDate: 2017-03-09; PartNumber: GRM1885C2A560JA01D; Cap_F: 56pF; VDC_V: 100V; ComponentLink1Description: Datasheet link; Supplier Part Number 1: 490-1345-1-ND; Technology: Ceramic; AEC Qualified: ?; ComponentLink1URL: http://search.murata.co.jp/Ceramy/PnsearchViewAction.do?HnOFG=ON&HnNFG=ON&SEL_CNT=50&sLang=en&sKey=GRM1885C2A560JA01D&x=9&y=9&search=startwith
C15 = CMP-0008646-2: CAP, CERM, 47 uF, 25 V, +/- 20%, JB, 1206; Manufacturer: TDK; TaMin_C: -55°C; Polarized: N; SizeAreaWB_mm2: 10.92; Value1: Unknown; U/M: EA; Value: 47uF; TaMax_C: 85°C; SizeZ_mm: 1.35; SizeX_mm: 3.2; SizeY_mm: 1.6; Cap_Case: 1206; SizeArea_mm2: 5.12; Cap_F: 47µF; AEC Category: Q200; ComponentLink1URL: https://product.tdk.com/info/en/documents/chara_sheet/C3216JB1E476M160AC.pdf; Supplier Part Number 2: 52X4488; Publisher: Texas Instruments; Supplier 2: Newark; Supplier Part Number 3: 810-C3216JB1E476M16C; TempCo: JB; Supplier 3: Mouser; Published: 2008-06-19; RoHS: Y; MountType: SMT; Supplier 1: Digi-Key; PackageReference: 1206; Tolerance_%: 20%; Value2: 25V; CompType: Capacitor; LatestRevisionDate: 2017-03-09; PartNumber: C3216JB1E476M160AC; AEC Qualified: N; ComponentLink1Description: Datasheet link; AEC Grade: N/A; Supplier Part Number 1: 445-11717-1-ND; Technology: Ceramic
C16 = CMP-0007575-2: CAP, CERM, 0.33 uF, 25 V, +/- 10%, X5R, 0805; Manufacturer: AVX; TaMin_C: -55°C; ESR_ohm: 0.02; Polarized: N; SizeAreaWB_mm2: 6.75; Value1: 0.02 ohm; U/M: EA; Value: 0.33uF; TaMax_C: 85°C; SizeZ_mm: 1.45; SizeX_mm: 2; SizeY_mm: 1.25; Cap_Case: 0805; SizeArea_mm2: 2.5; Cap_F: 330nF; AEC Category: Q200; ComponentLink1URL: http://datasheets.avx.com/cx5r.pdf; Supplier Part Number 2: 581-08053D334K; Publisher: Texas Instruments; Supplier 2: Mouser; Supplier Part Number 3: 1395952; TempCo: X5R; Supplier 3: Farnell; Published: 2008-06-19; RoHS: Y; MountType: SMT; Supplier 1: Digi-Key; PackageReference: 0805; Tolerance_%: 10%; Value2: 25V; CompType: Capacitor; LatestRevisionDate: 2017-03-09; PartNumber: 08053D334KAT2A; AEC Qualified: N; ComponentLink1Description: Datasheet link; AEC Grade: N/A; Supplier Part Number 1: 478-1406-1-ND; Technology: Ceramic
C17 = CMP-0006857-4: CAP, CERM, 0.1 uF, 16 V, +/- 5%, X7R, 0603; Manufacturer: Kemet; Polarized: N; CompType: Capacitor; Value: 0.1uF; U/M: EA; Cap_F: 100nF; Value1: Unknown; VDC_V: 16V; TaMin_C: -55°C; TaMax_C: 125°C; Cap_Case: 0603; AEC Category: Q200; SizeArea_mm2: 1.28; SizeAreaWB_mm2: 4.68; SizeX_mm: 1.6; SizeY_mm: 0.8; SizeZ_mm: 1; PartNumber: C0603C104J4RACTU; PackageReference: 0603; RoHS: Y; Tolerance_%: 5%; Value2: 16V; MountType: SMT; Technology: Ceramic; TempCo: X7R; Published: 2008-06-19; Publisher: Texas Instruments; LatestRevisionDate: 2017-03-09; ComponentLink1Description: Datasheet link; ComponentLink1URL: http://www.kemet.com/kemet/web/homepage/kechome.nsf/vapubfiles/F3102_Y5V.pdf/$file/F3102_Y5V.pdf; Supplier 1: Digi-Key; Supplier Part Number 1: 399-1097-1-ND; Supplier 2: Mouser; Supplier Part Number 2: 80-C0603C104J4R; Supplier 3: Farnell; Supplier Part Number 3: 1650834; AEC Qualified: ?
F1 = CMP-0077200-3: Fuse, 30 A, 250 VAC, 100 VDC, SMD; PartNumber: 0463030.ER; Manufacturer: Littelfuse; VAC_V: 250V; SizeAreaWB_mm2: 61.952; Rtyp_Ohm: 1.93m; SizeArea_mm2: 31.512; MeltingTyp: 916; SizeZ_mm: 3.12; VDC_V: 100V; SizeX_mm: 10.1; Interrupt_AC: 100A; Interrupt_DC: 50A; Fuse Speed: Fast; Fuse Technology: Board Mount; TaMax_C: 125°C; TaMin_C: -55°C; ComponentLink1Description: Datasheet URL; RoHS: Y; Supplier Part Number 3: 576-0463030.ER; Supplier 1: Digi-Key; Irating_A: 30A; PackageReference: 10.1x3.12mm; Supplier Part Number 2: 64W8551; Supplier 2: Newark; SizeY_mm: 3.12; ComponentLink1URL: http://www.littelfuse.com/~/media/electronics/datasheets/fuses/littelfuse_fuse_463_datasheet.pdf.pdf; CompType: Fuse; MountType: SMT; Supplier Part Number 1: F6439CT-ND; Supplier 3: Mouser
FAULT = CMP-0002829-3: LED, Red, SMD; Manufacturer: Lite-On; PartNumber: LTST-C170KRKT; Io_A: 20mA; SizeAreaWB_mm2: 6.75; Value1: W; SizeZ_mm: 1.2; SizeX_mm: 2; SizeY_mm: 1.25; Vf_V: 2V; SizeArea_mm2: 2.5; Color: red; RoHS: Y; MountType: SMT; PackageReference: Red 0805 LED; Value2: 2V; CompType: LED; Type: AlInGaP; ComponentLink1Description: Datasheet link; ComponentLink1URL: http://optoelectronics.liteon.com/upload/download/DS-22-99-0150/P_100_LTST-C170KRKT.pdf
GND = CMP-0075110-1: 1mm Uninsulated Shorting Plug, 10.16mm spacing, TH; Manufacturer: Harwin; CNHeader: False; Green_Lifecycle: Active; Green_REACh: Passed; CompType: Jumper Wire; ComponentLink1URL: http://cdn.harwin.com/pdfs/D3080-D3083.pdf; Supplier Part Number 2: 01E9240; Publisher: Texas Instruments; Supplier 2: Newark; Supplier Part Number 3: 855-D3082-05; Supplier 3: Mouser; RoHS: Y; MountType: TH; Green_EU RoHS-2: Passed; Supplier 1: Digi-Key; Green_EU RoHS: Passed with Exemption; PackageReference: Shorting Plug, 10.16mm spacing, TH; LatestRevisionDate: 2017-07-12; PartNumber: D3082-05; ComponentLink1Description: Datasheet URL; Supplier Part Number 1: 952-1873-ND; CT: False
J4 = CMP-0055527-1: Terminal Block, 9.52mm, 2x1, R/A, TH; PartNumber: 1902547; Manufacturer: Phoenix Contact; Pitch_mm: 9.52; Gender: Female; Row_Count: 1; Current_A: 32A; Voltage_V: 1kV; Cert_UL: Y; CNHeader: FALSE; CT: TRUE; PackageReference: Terminal Block, 2x1, Pitch 9.52mm; CompType: Terminal Block; RoHS: Y; MountType: TH; ComponentLink1Description: Datasheet URL; ComponentLink1URL: https://www.phoenixcontact.com/online/portal/in?uri=pxc-oc-itemdetail:pid=1902547&library=inen&tab=1&requestType=product&product; Publisher: Texas Instruments; LatestRevisionDate: 26/05/2017; Supplier 1: Digi-Key; Supplier Part Number 1: 277-5951-ND; Supplier 2: Mouser; Supplier Part Number 2: 651-1902547; Orientation: R/A; PinCount: 2; Color: Green; Cert_VDE: Y
L1 = CMP-0057541-2: Inductor, Drum Core, Ferrite, 68 uH, 1.1 A, 0.22 ohm, SMD; Manufacturer: Bourns; Isat: 2A @ 10% inductance drop; Irms: 1.1A @ 40C rise; Green_Lifecycle: Active; SizeAreaWB_mm2: 139.24; DCR_ohm: 0.22; Green_REACh: Passed; Value: 68uH; Imax_A: 1.1A; SizeZ_mm: 5.8; SizeX_mm: 9.8; SizeArea_mm2: 96.04; Ind_H: 68µH; AEC Category: Q200; ComponentLink1URL: http://www.bourns.com/data/global/pdfs/SDR1006.pdf; Supplier Part Number 2: 652-SDR1006-680KL; Publisher: Texas Instruments; Supplier 2: Mouser; Supplier Part Number 3: 1828084; Supplier 3: Farnell; Published: 2008-06-26; RoHS: Y; Value1: 0.22 ohm; Material: Ferrite; MountType: SMT; Green_EU RoHS-2: Incomplete; Supplier 1: Digi-Key; Green_EU RoHS: Passed; PackageReference: SDR1006; SizeY_mm: 9.8; Value2: 1.1A; CompType: Inductor; LatestRevisionDate: 2017-06-02; PartNumber: SDR1006-680KL; AEC Qualified: ?; ComponentLink1Description: Datasheet link; Supplier Part Number 1: SDR1006-680KLCT-ND; Technology: Drum Core
PVDD_TP = CMP-0055137-1: Test Point, Miniature, Red, TH; Manufacturer: Keystone; ContactFinish: Silver; CNHeader: FALSE; CT: TRUE; Green_Lifecycle: Active; Green_REACh: Passed; PartNumber: 5000; PackageReference: Red Miniature Testpoint; CompType: Test Point; RoHS: Y; MountType: TH; ComponentLink1Description: Datasheet URL; ComponentLink1URL: http://www.keyelco.com/userAssets/file/M60-2p60.pdf; Publisher: Texas Instruments; LatestRevisionDate: 26/05/2017; Supplier 1: Digi-Key; Supplier Part Number 1: 36-5000-ND; Supplier 2: Mouser; Supplier Part Number 2: 534-5000; Color: Red; Green_EU RoHS-2: Incomplete; Green_EU RoHS: Passed
R12 = CMP-0022663-4: as R74 on sheet MD029A_CSA; Supplier Part Number 2: 52K8787; Supplier 2: Newark; Supplier Part Number 3: 71-CRCW0603-97.6K-E3; Supplier 3: Mouser; RoHS: E; Value1: 1%; MountType: SMT; Supplier 1: Digi-Key; PackageReference: 0603; Tolerance_%: 1%; Res_ohm: 97.6k; CompType: Resistor; PartNumber: CRCW060397K6FKEA; ComponentLink1Description: Datasheet link; Supplier Part Number 1: 541-97.6KHCT-ND; Technology: Thick Film; ComponentLink1URL: http://www.vishay.com/docs/20035/dcrcwe3.pdf
R13 = CMP-0022371-4: as R80 on sheet MD029A_CSA; Supplier Part Number 2: 52K8370; Supplier 2: Newark; Supplier Part Number 3: 71-CRCW0603-3.01K-E3; Supplier 3: Mouser; RoHS: E; Value1: 1%; MountType: SMT; Supplier 1: Digi-Key; PackageReference: 0603; Tolerance_%: 1%; Res_ohm: 3.01k; CompType: Resistor; PartNumber: CRCW06033K01FKEA; ComponentLink1Description: Datasheet link; Supplier Part Number 1: 541-3.01KHCT-ND; Technology: Thick Film; ComponentLink1URL: http://www.vishay.com/docs/20035/dcrcwe3.pdf
R14 R15 = CMP-0025785-4: RES, 330, 5%, 0.1 W, AEC-Q200 Grade 0, 0603; Manufacturer: Vishay-Dale; Power_W: 100mW; TempCo: 200 ppm/C; Value_Code: 330R; Value: 330; EIA_Code: E24; SizeX_mm: 1.6; SizeY_mm: 0.8; SizeZ_mm: 1; Value2: 0.1W; SizeArea_mm2: 1.28; CompType: Resistor; AEC Qualified: Y; VDC_V: 75V; AEC Category: Q200; AEC Grade: 0; Supplier Part Number 2: 59M6805; Supplier 2: Newark; Supplier Part Number 3: 71-CRCW0603J-330-E3; Supplier 3: Mouser; RoHS: E; Value1: 5%; MountType: SMT; Supplier 1: Digi-Key; PackageReference: 0603; Tolerance_%: 5%; Res_ohm: 330; PartNumber: CRCW0603330RJNEA; ComponentLink1Description: Datasheet link; Supplier Part Number 1: 541-330GCT-ND; Technology: Thick Film; ComponentLink1URL: http://www.vishay.com/docs/20035/dcrcwe3.pdf
R16 R17 = CMP-0022458-4: RES, 4.99 k, 1%, 0.1 W, AEC-Q200 Grade 0, 0603; Manufacturer: Vishay-Dale; Value_Code: 4k99; Power_W: 100mW; Value2: 0.1W; VDC_V: 75V; TempCo: 100 ppm/C; EIA_Code: E96; AEC Category: Q200; AEC Qualified: Y; AEC Grade: 0; SizeArea_mm2: 1.28; SizeX_mm: 1.6; SizeY_mm: 0.8; SizeZ_mm: 1; CompType: Resistor; PartNumber: CRCW06034K99FKEA; PackageReference: 0603; RoHS: E; Res_ohm: 4.99k; Tolerance_%: 1%; Value1: 1%; MountType: SMT; Technology: Thick Film; ComponentLink1Description: Datasheet link; ComponentLink1URL: http://www.vishay.com/docs/20035/dcrcwe3.pdf; Supplier 1: Digi-Key; Supplier Part Number 1: 541-4.99KHCT-ND; Supplier 2: Newark; Supplier Part Number 2: 52K8500; Supplier 3: Mouser; Supplier Part Number 3: 71-CRCW0603-4.99K-E3; ValueDisplayed: 4.99k
R18 R25 R26 = CMP-0025697-4: as R64 on sheet MD029A_CSA; CompType: Resistor; PartNumber: CRCW06030000Z0EA; PackageReference: 0603; RoHS: E; Res_ohm: 0; Tolerance_%: 5%; Value1: 5%; MountType: SMT; Technology: Thick Film; ComponentLink1Description: Datasheet link; ComponentLink1URL: http://www.vishay.com/docs/20035/dcrcwe3.pdf; Supplier 1: Digi-Key; Supplier Part Number 1: 541-0.0GCT-ND; Supplier 2: Newark; Supplier Part Number 2: 52K8014; Supplier 3: Mouser; Supplier Part Number 3: 71-CRCW0603-0-E3; ValueDisplayed: 0; AEC Grade: 0
R19 = CMP-0025736-4: RES, 1.0 M, 5%, 0.1 W, AEC-Q200 Grade 0, 0603; Manufacturer: Vishay-Dale; Power_W: 100mW; TempCo: 200 ppm/C; Value_Code: 1M00; Value: 1.0Meg; EIA_Code: E24; Res_ohm: 1M; SizeX_mm: 1.6; SizeY_mm: 0.8; SizeZ_mm: 1; Value2: 0.1W; SizeArea_mm2: 1.28; AEC Qualified: Y; VDC_V: 75V; AEC Category: Q200; AEC Grade: 0; Supplier Part Number 2: 59M6756; Supplier 2: Newark; Supplier Part Number 3: 71-CRCW0603J-1.0M-E3; Supplier 3: Mouser; RoHS: E; Value1: 5%; MountType: SMT; Supplier 1: Digi-Key; PackageReference: 0603; Tolerance_%: 5%; CompType: Resistor; PartNumber: CRCW06031M00JNEA; ComponentLink1Description: Datasheet link; Supplier Part Number 1: 541-1.0MGCT-ND; Technology: Thick Film; ComponentLink1URL: http://www.vishay.com/docs/20035/dcrcwe3.pdf
R20 = CMP-0023236-4: RES, 681 k, 1%, 0.1 W, 0603; Manufacturer: Yageo; Power_W: 100mW; TempCo: 100 ppm/C; Value: 681k; EIA_Code: E96; SizeX_mm: 1.6; SizeY_mm: 0.8; SizeZ_mm: 1; Value2: 0.1W; SizeArea_mm2: 1.28; AEC Qualified: N; VDC_V: 75V; AEC Category: Q200; SizeAreaWB_mm2: 4.68; ComponentLink1URL: http://www.yageo.com/pdf/Pu-RC0603_51_PbFree_L_2.pdf; Supplier Part Number 2: 603-RC0603FR-07681KL; Supplier 2: Mouser; Supplier Part Number 3: 9238700; Supplier 3: Farnell; Value_Code: 681k; RoHS: Y; Value1: 1%; MountType: SMT; Supplier 1: Digi-Key; PackageReference: 0603; Tolerance_%: 1%; Res_ohm: 681k; CompType: Resistor; PartNumber: RC0603FR-07681KL; ComponentLink1Description: Datasheet link; Supplier Part Number 1: 311-681KHRCT-ND; Technology: Thick Film; AEC Grade: N/A
R21 = CMP-0023120-4: RES, 453 k, 1%, 0.1 W, 0603; Manufacturer: Yageo; Power_W: 100mW; TempCo: 100 ppm/C; Value: 453k; EIA_Code: E96; SizeX_mm: 1.6; SizeY_mm: 0.8; SizeZ_mm: 1; Value2: 0.1W; SizeArea_mm2: 1.28; AEC Qualified: N; VDC_V: 75V; AEC Category: Q200; SizeAreaWB_mm2: 4.68; ComponentLink1URL: http://www.yageo.com/pdf/Pu-RC0603_51_PbFree_L_2.pdf; Supplier Part Number 2: 603-RC0603FR-07453KL; Supplier 2: Mouser; Value_Code: 453k; RoHS: Y; Value1: 1%; MountType: SMT; Supplier 1: Digi-Key; PackageReference: 0603; Tolerance_%: 1%; Res_ohm: 453k; CompType: Resistor; PartNumber: RC0603FR-07453KL; ComponentLink1Description: Datasheet link; Supplier Part Number 1: 311-453KHRCT-ND; Technology: Thick Film; AEC Grade: N/A
R22 = CMP-0025784-4: RES, 330 k, 5%, 0.1 W, AEC-Q200 Grade 0, 0603; Manufacturer: Vishay-Dale; Power_W: 100mW; TempCo: 200 ppm/C; Value: 330k; EIA_Code: E24; SizeX_mm: 1.6; SizeY_mm: 0.8; SizeZ_mm: 1; Value2: 0.1W; SizeArea_mm2: 1.28; AEC Qualified: Y; VDC_V: 75V; AEC Category: Q200; AEC Grade: 0; Supplier Part Number 2: 59M6804; Supplier 2: Newark; Supplier Part Number 3: 71-CRCW0603J-330K-E3; Supplier 3: Mouser; Value_Code: 330k; RoHS: E; Value1: 5%; MountType: SMT; Supplier 1: Digi-Key; PackageReference: 0603; Tolerance_%: 5%; Res_ohm: 330k; CompType: Resistor; PartNumber: CRCW0603330KJNEA; ComponentLink1Description: Datasheet link; Supplier Part Number 1: 541-330KGCT-ND; Technology: Thick Film; ComponentLink1URL: http://www.vishay.com/docs/20035/dcrcwe3.pdf
R23 = CMP-0025950-3: RES, 100 k, 1%, 0.063 W, AEC-Q200 Grade 0, 0402; Manufacturer: Vishay-Dale; Power_W: 63mW; TempCo: 100 ppm/C; Value: 100k; EIA_Code: E96; SizeX_mm: 1; SizeY_mm: 0.5; SizeZ_mm: 0.6; Value2: 0.063W; AEC Qualified: Y; VDC_V: 50V; AEC Category: Q200; AEC Grade: 0; Supplier Part Number 2: 52K6607; Supplier 2: Newark; Supplier Part Number 3: 71-CRCW0402-100K-E3; Supplier 3: Mouser; Value_Code: 100k; RoHS: E; Value1: 1%; MountType: SMT; Supplier 1: Digi-Key; PackageReference: 0402; Tolerance_%: 1%; Res_ohm: 100k; SizeArea_mm2: 0.5; CompType: Resistor; PartNumber: CRCW0402100KFKED; ComponentLink1Description: Datasheet link; Supplier Part Number 1: 541-100KLCT-ND; Technology: Thick Film; ComponentLink1URL: http://www.vishay.com/docs/20035/dcrcwe3.pdf
R24 = CMP-0023142-5: RES, 49.9 k, 1%, 0.1 W, 0603; Manufacturer: Yageo; Power_W: 100mW; TempCo: 100 ppm/C; Value_Code: 49k9; Value: 49.9k; EIA_Code: E96; SizeX_mm: 1.6; SizeY_mm: 0.8; SizeZ_mm: 1; Value2: 0.1W; SizeArea_mm2: 1.28; AEC Qualified: N; VDC_V: 75V; AEC Category: Q200; SizeAreaWB_mm2: 4.68; Supplier Part Number 2: 603-RC0603FR-0749K9L; Supplier 2: Mouser; Supplier Part Number 3: 1799347; Supplier 3: Farnell; RoHS: Y; Value1: 1%; MountType: SMT; Supplier 1: Digi-Key; PackageReference: 0603; Tolerance_%: 1%; Res_ohm: 49.9k; CompType: Resistor; PartNumber: RC0603FR-0749K9L; ComponentLink1Description: Datasheet link; Supplier Part Number 1: 311-49.9KHRCT-ND; Technology: Thick Film; ComponentLink1URL: http://www.yageo.com/pdf/Pu-RC0603_51_PbFree_L_2.pdf; AEC Grade: N/A
U2 = CMP-0080798-1: 100-V Low IQ Synchronous Buck Regulator, DDA0008E (SOIC-8); Alternate Manufacturer: Texas Instruments; SizeAreaWB_mm2: 57.4; SizeZ_mm: 1.7; SizeX_mm: 5; SizeY_mm: 6.2; SizeArea_mm2: 31; CompType: IC; AEC Qualified: N; AEC Category: Q200; ComponentLink1URL: http://www.ti.com/lit/ds/symlink/lm5164.pdf; PackageDescription: SOIC-8; MountType: SMT; ComponentLink2URL: http://www.ti.com/product/lm5164; ComponentLink3Description: Online Datasheet; ComponentLink2Description: Product Folder; Manufacturer: Texas Instruments; ComponentLink3URL: http://www.ti.com/product/lm5164/datasheet; PackageReference: DDA0008E; PartNumber: LM5164DDAT; ComponentLink1Description: Datasheet Link
U3 = CMP-0080825-1: 500-mA, 25-V, Linear Voltage Regulators, DCY0004A (SOT-223-4); Alternate Manufacturer: Texas Instruments; Green_Lifecycle: Active; SizeAreaWB_mm2: 76.5; Green_REACh: Passed; SizeZ_mm: 1.8; SizeX_mm: 7; SizeY_mm: 6.5; SizeArea_mm2: 45.5; CompType: IC; AEC Qualified: N; AEC Category: Q200; ComponentLink1URL: http://www.ti.com/lit/ds/symlink/ua78m.pdf; Alternate PartNumber: UA78M33CDCY; PackageDescription: SOT-223-4; RoHS: Y; MountType: SMT; Green_EU RoHS-2: Passed; ComponentLink2URL: http://www.ti.com/product/ua78m; ComponentLink3Description: Online Datasheet; ComponentLink2Description: Product Folder; Manufacturer: Texas Instruments; Green_EU RoHS: Passed; ComponentLink3URL: http://www.ti.com/product/ua78m/datasheet; PackageReference: DCY0004A; PartNumber: UA78M33CDCYR; ComponentLink1Description: Datasheet Link
U4 U5 = CMP-0043120-3: 4-Channel ESD Solution for High-Speed Differential Interface, DRY0006A (USON-6); Manufacturer: Texas Instruments; Eco-Plan: Green (RoHS & no Sb/Br); Differential Capacitance(pF): 0.05; IEC 61000-4-2 Contact(+/- kV): 8; IO Capacitance(Typ)(pF): 0.8; Breakdown Voltage(Min)(V): 9; IO Leakage Current(nA): Jan-00; AEC Category: Q200; AEC Qualified: N; CompType: IC; SizeAreaWB_mm2: 4.9; SizeArea_mm2: 1.45; SizeX_mm: 1.0; SizeZ_mm: 0.6; Rating: Catalog; ComponentLink1Description: Datasheet Link; ComponentLink2URL: http://www.ti.com/product/tpd4s009; ComponentLink3URL: http://www.ti.com/product/tpd4s009/datasheet; PackageReference: DRY0006A; ComponentLink3Description: Online Datasheet; ComponentLink2Description: Product Folder; PackageDescription: USON-6; ComponentLink1URL: http://www.ti.com/lit/ds/symlink/tpd4s009.pdf; IEC 61000-4-2 Air-Gap(+/- kV): 9; PartNumber: TPD4S009DRYR; MountType: SMT; RoHS: Y; SizeY_mm: 1.45; Operating Temperature Range: -40 to 85 C